# EAGLE design Double_smd (EAGLE 7.5.0)
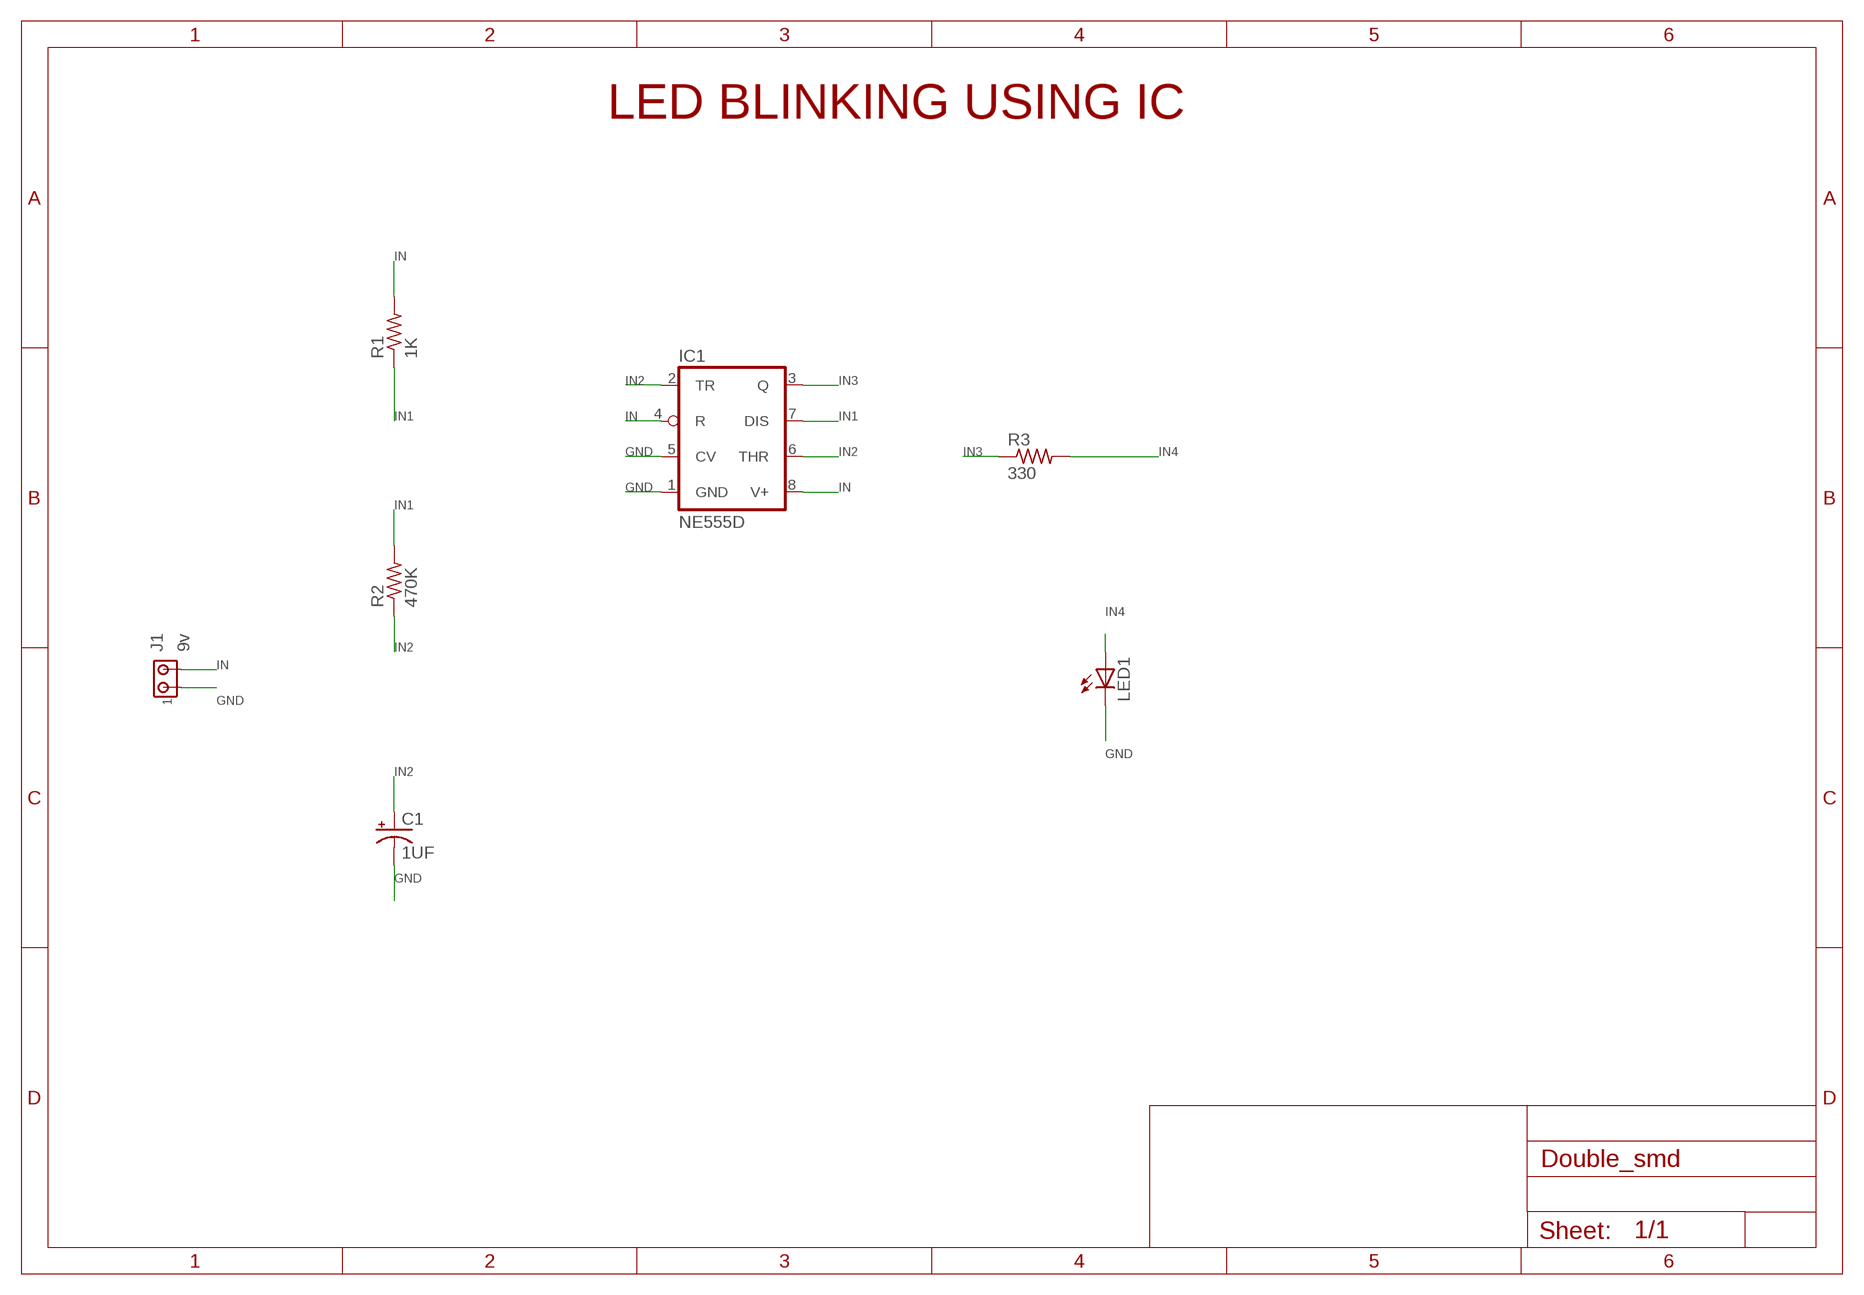
[diagram p0: schematic, sheet 1]

## Parts
C1  1UF  CPOL-US085CS-1R  [085CS_1R]
IC1  NE555D  [SO08]
J1  9v  MTA02-156  [1X2MTA]
LED1  LED5MM  [LED5MM]
R1  1K  R-US_R0805  [R0805]
R2  470K  R-US_R0805  [R0805]
R3  330  R-US_R0805  [R0805]

## Nets
GND: C1.- IC1.1(GND) IC1.5(CV) J1.1 LED1.K(C)
IN: IC1.4(R) IC1.8(V+) J1.2 R1.2
IN1: IC1.7(DIS) R1.1 R2.2
IN2: C1.+ IC1.2(TR) IC1.6(THR) R2.1
IN3: IC1.3(Q) R3.1
IN4: LED1.A R3.2

## Notes on the sheet
- LED BLINKING USING IC

## Library data of the parts
C1 = rcl:CPOL-US: POLARIZED CAPACITOR, American symbol
IC1 = linear:*555: TIMER
J1 = con-amp:MTA02-156: AMP connector
LED1 = led:LED: LED OSRAM: - CHIPLED LG R971, LG N971, LY N971, LG Q971, LY Q971, LO R971, LY R971 LH N974, LH R974 LS Q976, LO Q976, LY Q976 LO Q996 - Hyper CHIPLED LW Q18S LB Q993, LB Q99A, LB R99A - SideLED LS A670, LO A670, LY A670, LG A670, LP A670 LB A673, LV A673, LT A673, LW A673 LH A674 LY A675 LS A676, LA A676, LO A676, LY A676, LW A676 LS A679, LY A679, LG A679 - Hyper Micro SIDELED® LS Y876, LA Y876, LO Y876, LY Y876 LT Y87S - SmartLED LW L88C, LW L88S LB L89C, LB L89S, LG L890 LS L89K, LO L89K, LY L89K LS L896, LA L896, LO L896, LY L896 - TOPLED LS T670, LO T670, LY T670, LG T670, LP T670 LSG T670, LSP T670, LSY T670, LOP T670, LYG T670 LG T671, LOG T671, LSG T671 LB T673, LV T673, LT T673, LW T673 LH T674 LS T676, LA T676, LO T676, LY T676, LB T676, LH T676, LSB T676, LW T676 LB T67C, LV T67C, LT T67C, LS T67K, LO T67K, LY T67K, LW E67C LS E67B, LA E67B, LO E67B, LY E67B, LB E67C, LV E67C, LT E67C LW T67C LS T679, LY T679, LG T679 LS T770, LO T770, LY T770, LG T770, LP T770 LB T773, LV T773, LT T773, LW T773 LH T774 LS E675, LA E675, LY E675, LS T675 LS T776, LA T776, LO T776, LY T776, LB T776 LHGB T686 LT T68C, LB T68C - Hyper Mini TOPLED® LB M676 - Mini TOPLED Santana® LG M470 LS M47K, LO M47K, LY M47K Source: http://www.osram.convergy.de LUXEON: - LUMILED® LXK2-PW12-R00, LXK2-PW12-S00, LXK2-PW14-U00, LXK2-PW14-V00 LXK2-PM12-R00, LXK2-PM12-S00, LXK2-PM14-U00 LXK2-PE12-Q00, LXK2-PE12-R00, LXK2-PE12-S00, LXK2-PE14-T00, LXK2-PE14-U00 LXK2-PB12-K00, LXK2-PB12-L00, LXK2-PB12-M00, LXK2-PB14-N00, LXK2-PB14-P00, LXK2-PB14-Q00 LXK2-PR12-L00, LXK2-PR12-M00, LXK2-PR14-Q00, LXK2-PR14-R00 LXK2-PD12-Q00, LXK2-PD12-R00, LXK2-PD12-S00 LXK2-PH12-R00, LXK2-PH12-S00 LXK2-PL12-P00, LXK2-PL12-Q00, LXK2-PL12-R00 Source: www.luxeon.com KINGBRIGHT: KA-3528ASYC Source: www.kingbright.com
R1-R3 = rcl:R-US_: RESISTOR, American symbol

## Board
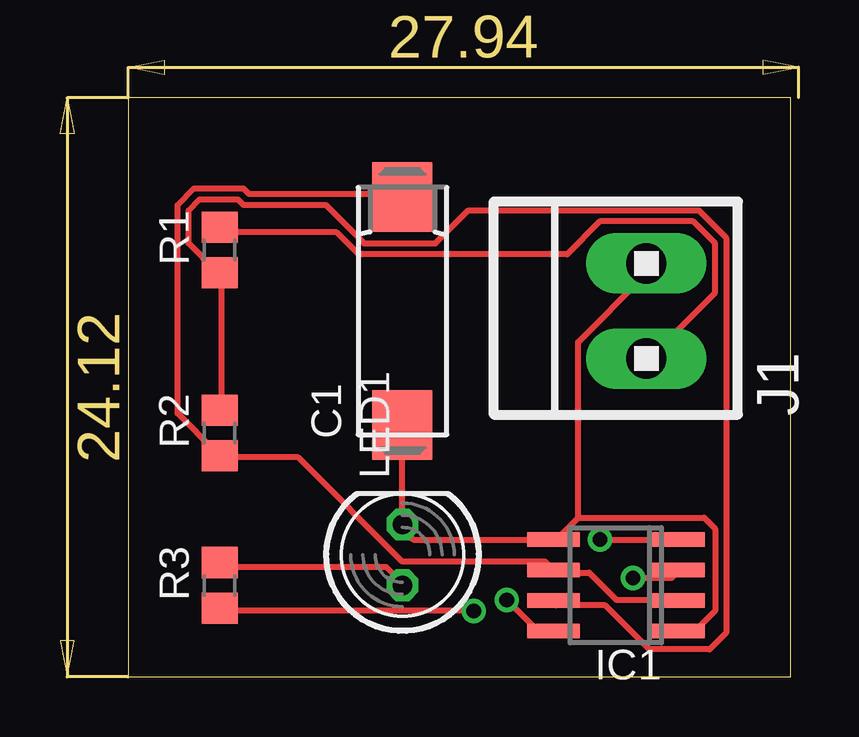
[diagram p1: board, top side]
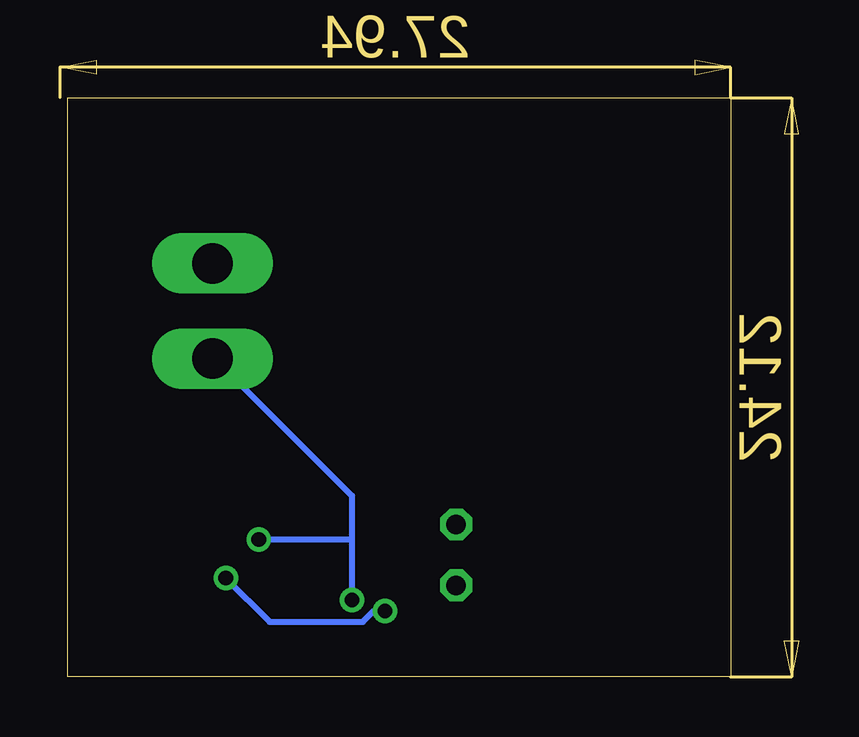
[diagram p2: board, bottom side, seen from below]

Size 27.61 x 24.12 mm. Coordinates in mm from the lower left corner, seen from the top.
Outline: 0,0 27.61,0 27.61,24.12 0,24.12 0,0
Copper layers (1*16): Top 0.035mm / dielectric 1.5mm / Bottom 0.035mm
Design rules "default": minimum track width 10mil, minimum drill 24mil, track to track 8mil, track to pad 8mil, pad to pad 8mil, via to via 8mil, smd to smd 8mil, copper to edge 40mil, drill to drill 8mil, minimum pad ring 10mil, minimum via ring 8mil, stop-mask expansion 4mil, vias tented up to drill 0mil, thermal gap 10mil

### Footprints (pad centres in the part's own frame; a part is rotated, then mirrored left to right if it is on the bottom)
085CS_1R = smd 2.9 x 2.5: + 4.75,0; - -4.75,0
SO08 = smd 0.6 x 2.2: 1 -1.905,-2.6; 2 -0.635,-2.6; 3 0.635,-2.6; 4 1.905,-2.6; 5 1.905,2.6; 6 0.635,2.6; 7 -0.635,2.6; 8 -1.905,2.6
1X2MTA = drill 1.676 long: 1 1.981,0; 2 -1.981,0
LED5MM = drill 0.813 octagon: A -1.27,0; K 1.27,0
R0805 = smd 1.3 x 1.5: 1 -0.95,0; 2 0.95,0

### Placement (x,y rotation side)
C1  11.43,15.24 90 top
IC1  20.32,3.81 90 top
J1  21.59,15.24 90 top
LED1  11.43,5.08 90 top
R1  3.81,17.78 90 top
R2  3.81,10.16 90 top
R3  3.81,3.81 90 top

### Tracks (layer width: path | path; a pad name or v marks a point on that pad's centre or on a via)
GND
  Top 0.254: 18.75,6.63 24,6.63 24.46,6.17 24.46,2.74 23.77,2.06 23.09,2.06 IC1.1 | 18.75,6.63 17.83,5.71 IC1.5 11.89,5.71 11.43,6.17 LED1.K C1.- | 18.75,6.63 18.75,13.95 21.49,16.69 21.49,17.14 J1.1
IN  (via drill 0.61)
  Top 0.254: R1.2 3.89,18.52 8.69,18.52 9.6,17.6 18.29,17.6 19.66,18.97 23.55,18.97 24.46,18.06 24.46,16 21.72,13.26 J1.2 | v15.77,3.2 16.92,2.06 17.6,2.06 IC1.8 | v19.66,5.71 IC1.4
  Bottom 0.254: 15.77,5.71 15.77,7.54 21.49,13.26 J1.2 | 15.77,5.71 v15.77,3.2 | 15.77,5.71 v19.66,5.71
IN1
  Top 0.254: R2.2 3.89,11.2 3.89,16.69 R1.1 3.66,16.92 2.52,18.06 2.52,19.43 2.97,19.89 4.57,19.89 4.8,19.66 8.23,19.66 9.83,18.06 12.8,18.06 14.17,19.43 23.77,19.43 24.92,18.29 24.92,1.83 24.23,1.14 21.72,1.14 19.89,2.97 17.83,2.97 IC1.7
IN2
  Top 0.254: IC1.2 22.86,3.2 20.34,3.2 19.2,4.34 17.83,4.34 IC1.6 17.6,4.57 17.37,4.8 11.43,4.8 7.09,9.14 3.89,9.14 R2.1 3.66,9.37 2.06,10.97 2.06,19.66 2.74,20.34 4.8,20.34 5.03,20.12 11.43,20.12 C1.+
IN3  (via drill 0.61)
  Top 0.254: v14.4,2.74 3.89,2.74 R3.1 | v21.03,4.12 22.63,4.12 22.86,4.34 IC1.3
  Bottom 0.254: v14.4,2.74 14.86,2.74 15.32,2.29 19.2,2.29 v21.03,4.12
IN4
  Top 0.254: R3.2 3.89,4.57 10.74,4.57 11.43,3.89 LED1.A